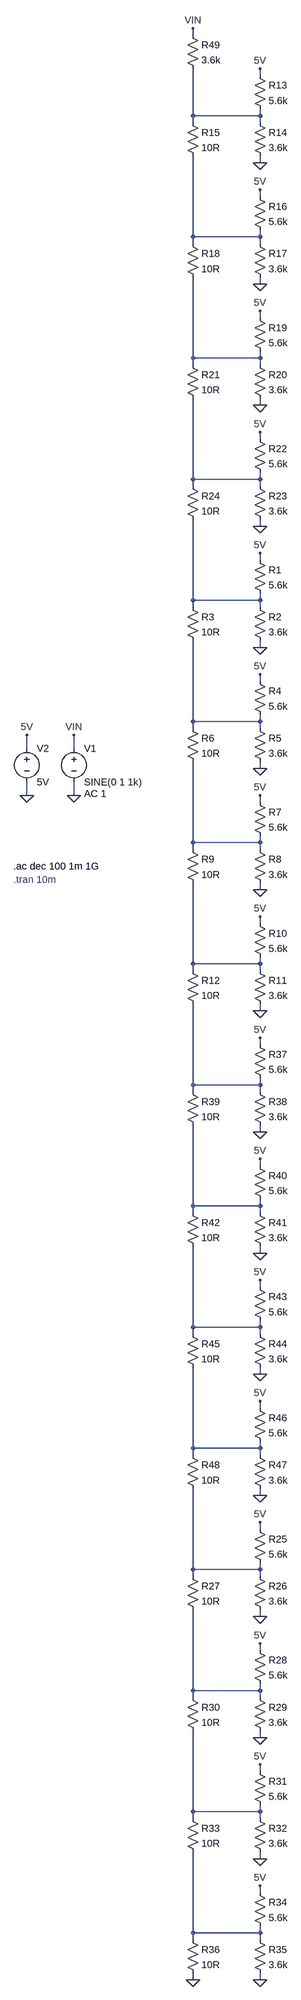
[diagram p0: schematic ResistorLadder.asc]
ResistorLadder.asc, the LTspice schematic file:
Version 4
SHEET 1 880 3236
WIRE 0 -1408 0 -1424
WIRE 160 -1312 160 -1328
WIRE 0 -1216 0 -1328
WIRE 160 -1216 160 -1232
WIRE 160 -1216 0 -1216
WIRE 0 -1200 0 -1216
WIRE 160 -1200 160 -1216
WIRE 160 -1104 160 -1120
WIRE 160 -1024 160 -1040
WIRE 0 -928 0 -1120
WIRE 160 -928 160 -944
WIRE 160 -928 0 -928
WIRE 0 -912 0 -928
WIRE 160 -912 160 -928
WIRE 160 -816 160 -832
WIRE 160 -736 160 -752
WIRE 0 -640 0 -832
WIRE 160 -640 160 -656
WIRE 160 -640 0 -640
WIRE 0 -624 0 -640
WIRE 160 -624 160 -640
WIRE 160 -528 160 -544
WIRE 160 -448 160 -464
WIRE 0 -352 0 -544
WIRE 160 -352 160 -368
WIRE 160 -352 0 -352
WIRE 0 -336 0 -352
WIRE 160 -336 160 -352
WIRE 160 -240 160 -256
WIRE 160 -160 160 -176
WIRE 0 -64 0 -256
WIRE 160 -64 160 -80
WIRE 160 -64 0 -64
WIRE 0 -48 0 -64
WIRE 160 -48 160 -64
WIRE 160 48 160 32
WIRE 160 128 160 112
WIRE 0 224 0 32
WIRE 160 224 160 208
WIRE 160 224 0 224
WIRE 0 240 0 224
WIRE 160 240 160 224
WIRE -896 288 -896 256
WIRE -784 288 -784 256
WIRE 160 336 160 320
WIRE -896 400 -896 368
WIRE -784 400 -784 368
WIRE 160 416 160 400
WIRE 0 512 0 320
WIRE 160 512 160 496
WIRE 160 512 0 512
WIRE 0 528 0 512
WIRE 160 528 160 512
WIRE 160 624 160 608
WIRE 160 704 160 688
WIRE 0 800 0 608
WIRE 160 800 160 784
WIRE 160 800 0 800
WIRE 0 816 0 800
WIRE 160 816 160 800
WIRE 160 912 160 896
WIRE 160 992 160 976
WIRE 0 1088 0 896
WIRE 160 1088 160 1072
WIRE 160 1088 0 1088
WIRE 0 1104 0 1088
WIRE 160 1104 160 1088
WIRE 160 1200 160 1184
WIRE 160 1280 160 1264
WIRE 0 1376 0 1184
WIRE 160 1376 160 1360
WIRE 160 1376 0 1376
WIRE 0 1392 0 1376
WIRE 160 1392 160 1376
WIRE 160 1488 160 1472
WIRE 160 1568 160 1552
WIRE 0 1664 0 1472
WIRE 160 1664 160 1648
WIRE 160 1664 0 1664
WIRE 0 1680 0 1664
WIRE 160 1680 160 1664
WIRE 160 1776 160 1760
WIRE 160 1856 160 1840
WIRE 0 1952 0 1760
WIRE 160 1952 160 1936
WIRE 160 1952 0 1952
WIRE 0 1968 0 1952
WIRE 160 1968 160 1952
WIRE 160 2064 160 2048
WIRE 160 2144 160 2128
WIRE 0 2240 0 2048
WIRE 160 2240 160 2224
WIRE 160 2240 0 2240
WIRE 0 2256 0 2240
WIRE 160 2256 160 2240
WIRE 160 2352 160 2336
WIRE 160 2432 160 2416
WIRE 0 2528 0 2336
WIRE 160 2528 160 2512
WIRE 160 2528 0 2528
WIRE 0 2544 0 2528
WIRE 160 2544 160 2528
WIRE 160 2640 160 2624
WIRE 160 2720 160 2704
WIRE 0 2816 0 2624
WIRE 160 2816 160 2800
WIRE 160 2816 0 2816
WIRE 0 2832 0 2816
WIRE 160 2832 160 2816
WIRE 160 2928 160 2912
WIRE 160 3008 160 2992
WIRE 0 3104 0 2912
WIRE 160 3104 160 3088
WIRE 160 3104 0 3104
WIRE 0 3120 0 3104
WIRE 160 3120 160 3104
WIRE 0 3216 0 3200
WIRE 160 3216 160 3200
FLAG -784 400 0
FLAG -896 400 0
FLAG -896 256 5V
FLAG -784 256 VIN
FLAG 160 -176 5V
FLAG 160 48 0
FLAG 160 112 5V
FLAG 160 336 0
FLAG 160 400 5V
FLAG 160 624 0
FLAG 160 688 5V
FLAG 160 912 0
FLAG 160 -1328 5V
FLAG 160 -1104 0
FLAG 160 -1040 5V
FLAG 160 -816 0
FLAG 160 -752 5V
FLAG 160 -528 0
FLAG 160 -464 5V
FLAG 160 -240 0
FLAG 160 2128 5V
FLAG 160 2352 0
FLAG 160 2416 5V
FLAG 160 2640 0
FLAG 160 2704 5V
FLAG 160 2928 0
FLAG 160 2992 5V
FLAG 160 3216 0
FLAG 160 976 5V
FLAG 160 1200 0
FLAG 160 1264 5V
FLAG 160 1488 0
FLAG 160 1552 5V
FLAG 160 1776 0
FLAG 160 1840 5V
FLAG 160 2064 0
FLAG 0 3216 0
FLAG 0 -1424 VIN
SYMBOL voltage -784 272 R0
WINDOW 123 24 124 Left 2
WINDOW 39 0 0 Left 0
SYMATTR Value2 AC 1
SYMATTR InstName V1
SYMATTR Value SINE(0 1 1k)
SYMBOL voltage -896 272 R0
WINDOW 123 0 0 Left 0
WINDOW 39 0 0 Left 0
SYMATTR InstName V2
SYMATTR Value 5V
SYMBOL res 144 -176 R0
SYMATTR InstName R1
SYMATTR Value 5.6k
SYMBOL res 144 -64 R0
SYMATTR InstName R2
SYMATTR Value 3.6k
SYMBOL res -16 -64 R0
SYMATTR InstName R3
SYMATTR Value 10R
SYMBOL res 144 112 R0
SYMATTR InstName R4
SYMATTR Value 5.6k
SYMBOL res 144 224 R0
SYMATTR InstName R5
SYMATTR Value 3.6k
SYMBOL res -16 224 R0
SYMATTR InstName R6
SYMATTR Value 10R
SYMBOL res 144 400 R0
SYMATTR InstName R7
SYMATTR Value 5.6k
SYMBOL res 144 512 R0
SYMATTR InstName R8
SYMATTR Value 3.6k
SYMBOL res -16 512 R0
SYMATTR InstName R9
SYMATTR Value 10R
SYMBOL res 144 688 R0
SYMATTR InstName R10
SYMATTR Value 5.6k
SYMBOL res 144 800 R0
SYMATTR InstName R11
SYMATTR Value 3.6k
SYMBOL res -16 800 R0
SYMATTR InstName R12
SYMATTR Value 10R
SYMBOL res 144 -1328 R0
SYMATTR InstName R13
SYMATTR Value 5.6k
SYMBOL res 144 -1216 R0
SYMATTR InstName R14
SYMATTR Value 3.6k
SYMBOL res -16 -1216 R0
SYMATTR InstName R15
SYMATTR Value 10R
SYMBOL res 144 -1040 R0
SYMATTR InstName R16
SYMATTR Value 5.6k
SYMBOL res 144 -928 R0
SYMATTR InstName R17
SYMATTR Value 3.6k
SYMBOL res -16 -928 R0
SYMATTR InstName R18
SYMATTR Value 10R
SYMBOL res 144 -752 R0
SYMATTR InstName R19
SYMATTR Value 5.6k
SYMBOL res 144 -640 R0
SYMATTR InstName R20
SYMATTR Value 3.6k
SYMBOL res -16 -640 R0
SYMATTR InstName R21
SYMATTR Value 10R
SYMBOL res 144 -464 R0
SYMATTR InstName R22
SYMATTR Value 5.6k
SYMBOL res 144 -352 R0
SYMATTR InstName R23
SYMATTR Value 3.6k
SYMBOL res -16 -352 R0
SYMATTR InstName R24
SYMATTR Value 10R
SYMBOL res 144 2128 R0
SYMATTR InstName R25
SYMATTR Value 5.6k
SYMBOL res 144 2240 R0
SYMATTR InstName R26
SYMATTR Value 3.6k
SYMBOL res -16 2240 R0
SYMATTR InstName R27
SYMATTR Value 10R
SYMBOL res 144 2416 R0
SYMATTR InstName R28
SYMATTR Value 5.6k
SYMBOL res 144 2528 R0
SYMATTR InstName R29
SYMATTR Value 3.6k
SYMBOL res -16 2528 R0
SYMATTR InstName R30
SYMATTR Value 10R
SYMBOL res 144 2704 R0
SYMATTR InstName R31
SYMATTR Value 5.6k
SYMBOL res 144 2816 R0
SYMATTR InstName R32
SYMATTR Value 3.6k
SYMBOL res -16 2816 R0
SYMATTR InstName R33
SYMATTR Value 10R
SYMBOL res 144 2992 R0
SYMATTR InstName R34
SYMATTR Value 5.6k
SYMBOL res 144 3104 R0
SYMATTR InstName R35
SYMATTR Value 3.6k
SYMBOL res -16 3104 R0
SYMATTR InstName R36
SYMATTR Value 10R
SYMBOL res 144 976 R0
SYMATTR InstName R37
SYMATTR Value 5.6k
SYMBOL res 144 1088 R0
SYMATTR InstName R38
SYMATTR Value 3.6k
SYMBOL res -16 1088 R0
SYMATTR InstName R39
SYMATTR Value 10R
SYMBOL res 144 1264 R0
SYMATTR InstName R40
SYMATTR Value 5.6k
SYMBOL res 144 1376 R0
SYMATTR InstName R41
SYMATTR Value 3.6k
SYMBOL res -16 1376 R0
SYMATTR InstName R42
SYMATTR Value 10R
SYMBOL res 144 1552 R0
SYMATTR InstName R43
SYMATTR Value 5.6k
SYMBOL res 144 1664 R0
SYMATTR InstName R44
SYMATTR Value 3.6k
SYMBOL res -16 1664 R0
SYMATTR InstName R45
SYMATTR Value 10R
SYMBOL res 144 1840 R0
SYMATTR InstName R46
SYMATTR Value 5.6k
SYMBOL res 144 1952 R0
SYMATTR InstName R47
SYMATTR Value 3.6k
SYMBOL res -16 1952 R0
SYMATTR InstName R48
SYMATTR Value 10R
SYMBOL res -16 -1424 R0
SYMATTR InstName R49
SYMATTR Value 3.6k
TEXT -928 568 Left 2 !.ac dec 100 1m 1G
TEXT -928 600 Left 2 ;.tran 10m

The netlist it stands for:
* ResistorLadder.asc
V1 VIN 0 SINE(0 1 1k) AC 1
V2 5V 0 5V
R1 5V N005 5.6k
R2 N005 0 3.6k
R3 N005 N006 10R
R4 5V N006 5.6k
R5 N006 0 3.6k
R6 N006 N007 10R
R7 5V N007 5.6k
R8 N007 0 3.6k
R9 N007 N008 10R
R10 5V N008 5.6k
R11 N008 0 3.6k
R12 N008 N009 10R
R13 5V N001 5.6k
R14 N001 0 3.6k
R15 N001 N002 10R
R16 5V N002 5.6k
R17 N002 0 3.6k
R18 N002 N003 10R
R19 5V N003 5.6k
R20 N003 0 3.6k
R21 N003 N004 10R
R22 5V N004 5.6k
R23 N004 0 3.6k
R24 N004 N005 10R
R25 5V N013 5.6k
R26 N013 0 3.6k
R27 N013 N014 10R
R28 5V N014 5.6k
R29 N014 0 3.6k
R30 N014 N015 10R
R31 5V N015 5.6k
R32 N015 0 3.6k
R33 N015 N016 10R
R34 5V N016 5.6k
R35 N016 0 3.6k
R36 N016 0 10R
R37 5V N009 5.6k
R38 N009 0 3.6k
R39 N009 N010 10R
R40 5V N010 5.6k
R41 N010 0 3.6k
R42 N010 N011 10R
R43 5V N011 5.6k
R44 N011 0 3.6k
R45 N011 N012 10R
R46 5V N012 5.6k
R47 N012 0 3.6k
R48 N012 N013 10R
R49 VIN N001 3.6k
.ac dec 100 1m 1G
* .tran 10m
.backanno
.end